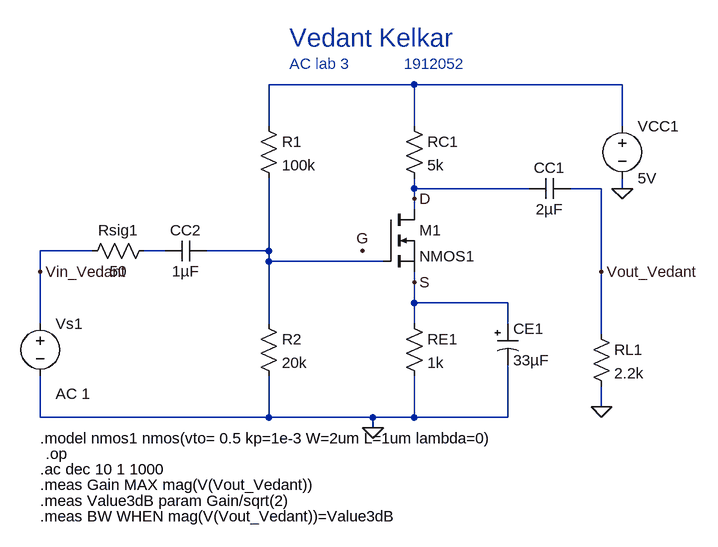
[diagram p0: schematic AC2_lab3.asc]
AC2_lab3.asc, the LTspice schematic file:
Version 4
SHEET 1 1036 840
WIRE 272 160 48 160
WIRE 592 160 272 160
WIRE 48 224 48 160
WIRE 272 224 272 160
WIRE 592 224 592 160
WIRE 272 320 272 304
WIRE 448 320 272 320
WIRE 560 320 512 320
WIRE 592 320 592 304
WIRE 272 336 272 320
WIRE 272 352 272 336
WIRE -224 416 -304 416
WIRE -112 416 -144 416
WIRE 48 416 48 304
WIRE 48 416 -48 416
WIRE 48 432 48 416
WIRE 224 432 48 432
WIRE -304 448 -304 416
WIRE 560 448 560 320
WIRE 272 464 272 448
WIRE 272 496 272 464
WIRE 416 496 272 496
WIRE -304 528 -304 448
WIRE 48 528 48 432
WIRE 272 528 272 496
WIRE 416 528 416 496
WIRE 560 544 560 448
WIRE 560 656 560 624
WIRE -304 672 -304 608
WIRE 48 672 48 608
WIRE 48 672 -304 672
WIRE 208 672 48 672
WIRE 272 672 272 608
WIRE 272 672 208 672
WIRE 416 672 416 592
WIRE 416 672 272 672
WIRE 208 688 208 672
FLAG 560 656 0
FLAG 592 320 0
FLAG 208 688 0
FLAG -304 448 Vin_Vedant
FLAG 560 448 Vout_Vedant
FLAG 192 416 G
FLAG 272 464 S
FLAG 272 336 D
SYMBOL res 32 208 R0
SYMATTR InstName R1
SYMATTR Value 100k
SYMBOL res 256 208 R0
SYMATTR InstName RC1
SYMATTR Value 5k
SYMBOL res 256 512 R0
SYMATTR InstName RE1
SYMATTR Value 1k
SYMBOL res 32 512 R0
SYMATTR InstName R2
SYMATTR Value 20k
SYMBOL res -128 400 R90
WINDOW 0 0 56 VBottom 2
WINDOW 3 32 56 VTop 2
SYMATTR InstName Rsig1
SYMATTR Value 50
SYMBOL voltage -304 512 R0
WINDOW 123 24 124 Left 2
WINDOW 39 0 0 Left 0
SYMATTR Value2 AC 1
SYMATTR InstName Vs1
SYMATTR Value ""
SYMBOL res 544 528 R0
SYMATTR InstName RL1
SYMATTR Value 2.2k
SYMBOL polcap 400 528 R0
WINDOW 3 24 56 Left 2
SYMATTR Value 33µF
SYMATTR InstName CE1
SYMATTR Description Capacitor
SYMATTR Type cap
SYMATTR SpiceLine V=6.3 Irms=2.21565 Rser=0.055 Lser=0 mfg="KEMET" pn="A700V106M006ATE055" type="Al electrolytic"
SYMBOL voltage 592 208 R0
SYMATTR InstName VCC1
SYMATTR Value 5V
SYMBOL cap 512 304 R90
WINDOW 0 0 32 VBottom 2
WINDOW 3 32 32 VTop 2
SYMATTR InstName CC1
SYMATTR Value 2µF
SYMBOL cap -48 400 R90
WINDOW 0 0 32 VBottom 2
WINDOW 3 32 32 VTop 2
SYMATTR InstName CC2
SYMATTR Value 1µF
SYMBOL nmos 224 352 R0
SYMATTR InstName M1
SYMATTR Value NMOS1
TEXT 80 88 Left 4 ;Vedant Kelkar
TEXT 256 128 Left 2 ;1912052
TEXT 80 128 Left 2 ;AC lab 3
TEXT -304 704 Left 2 !.model nmos1 nmos(vto= 0.5 kp=1e-3 W=2um L=1um lambda=0)
TEXT -304 752 Left 2 !.ac dec 10 1 1000
TEXT -304 776 Left 2 !.meas Gain MAX mag(V(Vout_Vedant))
TEXT -304 800 Left 2 !.meas Value3dB param Gain/sqrt(2)
TEXT -304 824 Left 2 !.meas BW WHEN mag(V(Vout_Vedant))=Value3dB
TEXT -296 728 Left 2 !.op

The netlist it stands for:
* AC2_lab3.asc
R1 N001 N003 100k
RC1 N001 D 5k
RE1 S 0 1k
R2 N003 0 20k
Rsig1 N002 Vin_Vedant 50
Vs1 Vin_Vedant 0 AC 1
RL1 Vout_Vedant 0 2.2k
CE1 S 0 33µF V=6.3 Irms=2.21565 Rser=0.055 Lser=0 mfg="KEMET" pn="A700V106M006ATE055" type="Al electrolytic"
VCC1 N001 0 5V
CC1 Vout_Vedant D 2µF
CC2 N003 N002 1µF
M1 D N003 S S NMOS1
.model NMOS NMOS
.model PMOS PMOS
.lib standard.mos
* Vedant Kelkar
* 1912052
* AC lab 3
.model nmos1 nmos(vto= 0.5 kp=1e-3 W=2um L=1um lambda=0)
.ac dec 10 1 1000
.meas Gain MAX mag(V(Vout_Vedant))
.meas Value3dB param Gain/sqrt(2)
.meas BW WHEN mag(V(Vout_Vedant))=Value3dB
.op
.backanno
.end